# Altium schematic sheet BUTTONS_LEDS.schdoc
size 243 x 222 mm
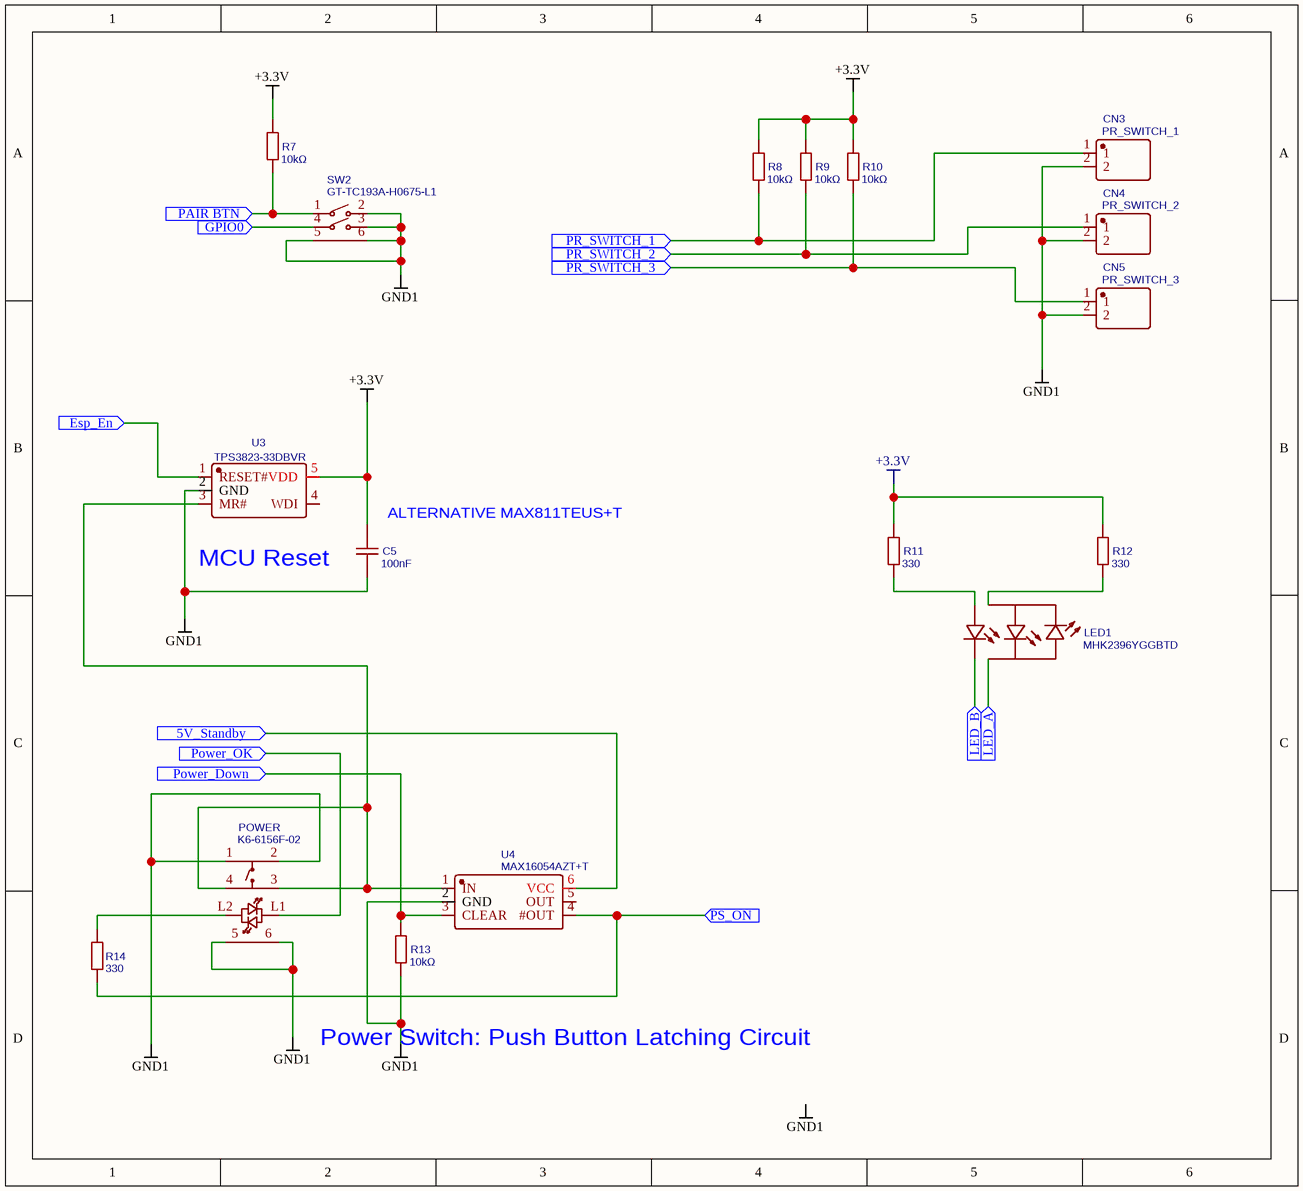
[diagram p0: BUTTONS_LEDS.schdoc]

## Parts
C5  100nF  [C0805]
CN3  PR_SWITCH_1  [CONN-TH_B2B-XH-AM-LF-SN]
CN4  PR_SWITCH_2  [CONN-TH_B2B-XH-AM-LF-SN]
CN5  PR_SWITCH_3  [CONN-TH_B2B-XH-AM-LF-SN]
LED1  MHK2396YGGBTD  [LED-TH_MHK2396YGGBTD]
POWER  K6-6156F-02  [SW-TH_K6-6156F-02]
R7  10kΩ  [R0805]
R8  10kΩ  [R0805]
R9  10kΩ  [R0805]
R10  10kΩ  [R0805]
R11  330  [R0805]
R12  330  [R0805]
R13  10kΩ  [R0805]
R14  330  [R0805]
SW2  GT-TC193A-H0675-L1  [SW-TH_GT-TC193A-H0675-L1]
U3  TPS3823-33DBVR  [SOT-23-5_L3.0-W1.7-P0.95-LS2.8-BR]
U4  MAX16054AZT+T  [TSOT-23-6_L2.9-W1.6-P0.95-LS2.8-TL]

## Ports
5V_Standby (in), Esp_En (in), GPIO0 (in), LED_A (in), LED_B (in), PAIR BTN (in), Power_Down (in), Power_OK (in), PR_SWITCH_1 (in), PR_SWITCH_2 (in), PR_SWITCH_3 (in), PS_ON (in)

## Nets
+3.3V: C5.2 R7.2 R8.2 R9.2 R10.2 R11.2 R12.2 U3.5(VDD)
GND1: C5.1 CN3.2 CN4.2 CN5.2 POWER.1 POWER.2 POWER.5 POWER.6 R13.1 SW2.2(b) SW2.3(d) SW2.5 SW2.6 U3.2(GND) U4.2(GND)
5V_Standby: U4.6(VCC) ; port 5V_Standby
Esp_En: U3.1(RESET#) ; port Esp_En
GPIO0: SW2.4(c) ; port GPIO0
LED_A: LED1.2 ; port LED_A
LED_B: LED1.4 ; port LED_B
PAIR BTN: R7.1 SW2.1(a) ; port PAIR BTN
Power_Down: R13.2 U4.3(CLEAR) ; port Power_Down
Power_OK: POWER.L1 ; port Power_OK
PR_SWITCH_1: CN3.1 R8.1 ; port PR_SWITCH_1
PR_SWITCH_2: CN4.1 R9.1 ; port PR_SWITCH_2
PR_SWITCH_3: CN5.1 R10.1 ; port PR_SWITCH_3
PS_ON: R14.1 U4.4(#OUT) ; port PS_ON
NetLED1_1: LED1.1 R12.1
NetLED1_3: LED1.3 R11.1
NetPOWER_3: POWER.3 POWER.4 U3.3(MR#) U4.1(IN)
NetPOWER_L2: POWER.L2 R14.2

Not connected (* = marked no-connect by the designer): U3 4(WDI); U4 5(OUT)

## Notes on the sheet
- (near C5) ALTERNATIVE MAX811TEUS+T
- MCU Reset
- Power Switch: Push Button Latching Circuit
- Labels drawn without touching a wire or pin: GND1

## Library data of the parts
C5 = 100nF: BOM_Manufacturer: YAGEO; BOM_Manufacturer Part: CC0805KRX7R8BB104; nameAlias: Capacitance; Contributor: LCSC; BOM_Supplier: LCSC; BOM_Supplier Part: C519981; BOM_JLCPCB Part Class: Extended Part; spicePre: C; spiceSymbolName: CC0805KRX7R8BB104
CN3 = PR_SWITCH_1: BOM_Manufacturer: JST Sales America; Contributor: LCSC; BOM_Supplier: LCSC; BOM_Supplier Part: C161869; BOM_Manufacturer Part: -; BOM_JLCPCB Part Class: Extended Part; spicePre: C; spiceSymbolName: B2B-XH-AM (LF)(SN)
CN4 = PR_SWITCH_2: BOM_Manufacturer: JST Sales America; Contributor: LCSC; BOM_Supplier: LCSC; BOM_Supplier Part: C161869; BOM_Manufacturer Part: -; BOM_JLCPCB Part Class: Extended Part; spicePre: C; spiceSymbolName: B2B-XH-AM (LF)(SN)
CN5 = PR_SWITCH_3: BOM_Manufacturer: JST Sales America; Contributor: LCSC; BOM_Supplier: LCSC; BOM_Supplier Part: C161869; BOM_Manufacturer Part: -; BOM_JLCPCB Part Class: Extended Part; spicePre: C; spiceSymbolName: B2B-XH-AM (LF)(SN)
LED1 = MHK2396YGGBTD: BOM_Manufacturer: MEIHUA; Contributor: LCSC; BOM_Supplier: LCSC; BOM_Supplier Part: C409768; BOM_Manufacturer Part: MHK2396YGGBTD; BOM_JLCPCB Part Class: Extended Part; spicePre: L; spiceSymbolName: MHK2396YGGBTD
POWER = K6-6156F-02: BOM_Manufacturer: 韩国韩荣; Contributor: LCSC; BOM_Supplier: LCSC; BOM_Supplier Part: C2848638; BOM_Manufacturer Part: K6-6156F-02; spicePre: S; spiceSymbolName: K6-6156F-02
R7-R10 R13 = 10kΩ: BOM_Manufacturer: Ever Ohms Tech; BOM_Manufacturer Part: TR0805D10KP0550; Resistance (Ohms): 10K; nameAlias: Resistance; Contributor: LCSC; BOM_Supplier: LCSC; BOM_Supplier Part: C332266; BOM_JLCPCB Part Class: Extended Part; spicePre: R; spiceSymbolName: TR0805D10KP0550
R11 R12 R14 = 330: BOM_Manufacturer: YAGEO; BOM_Manufacturer Part: AC0805FR-07330RL; nameAlias: Resistance (Ohms); Contributor: LCSC; Resistance: 330Ω; BOM_Supplier: LCSC; BOM_Supplier Part: C144564; BOM_JLCPCB Part Class: Extended Part; spicePre: R; spiceSymbolName: AC0805FR-07330RL
SW2 = GT-TC193A-H0675-L1: BOM_Manufacturer: G-Switch(品赞); Contributor: LCSC; BOM_Supplier: LCSC; BOM_Supplier Part: C2835017; BOM_Manufacturer Part: GT-TC193A-H0675-L1; spicePre: S; spiceSymbolName: GT-TC193A-H0675-L1
U3 = TPS3823-33DBVR: BOM_Manufacturer: TI; spicePre: X; BOM_Supplier: LCSC; BOM_Manufacturer Part: TPS3823-33DBVR; BOM_Supplier Part: C7719; BOM_JLCPCB Part Class: Extended Part; spiceSymbolName: TPS3823-33DBVR
U4 = MAX16054AZT+T: BOM_Manufacturer: MAXIM; Contributor: LCSC; BOM_Supplier: LCSC; BOM_Manufacturer Part: MAX16054AZT+T; BOM_Supplier Part: C79401; BOM_JLCPCB Part Class: Extended Part; spicePre: U; spiceSymbolName: MAX16054AZT+T